# Altium schematic sheet [04] - 7 SEGMENT DISPS.SchDoc: 7 SEGMENT DISPLAYS
size 433 x 279 mm; Author: ZAG; DrawnBy: ZAG; DocumentNumber: 5; SheetNumber: 4; SheetTotal: 7; PageSetup: Record=PageOptions|CenterHorizontal=True|CenterVertical=True|PrintScale=0.96|XCorrection=1.00|YCorrection=1.00|PrintKind=2|BorderSize=5000000|LeftOffset=0|BottomOffset=0|Orientation=2|PaperLength=4318|PaperWidth=2794|Scale=100|PaperSource=15|PrintQuality=600|MediaType=1|DitherType=10|PaperKind=11x17|PrintScaleMode=1; ClientCompanyName: Mule Labs, LLC; ClientContactEmail: zack@mule-labs.com; PCBRevision: 01; SchRevision: 01; Project: YOUTUBE SUBSCRIBER COUNTER; SchStatus: PRELIMINARY
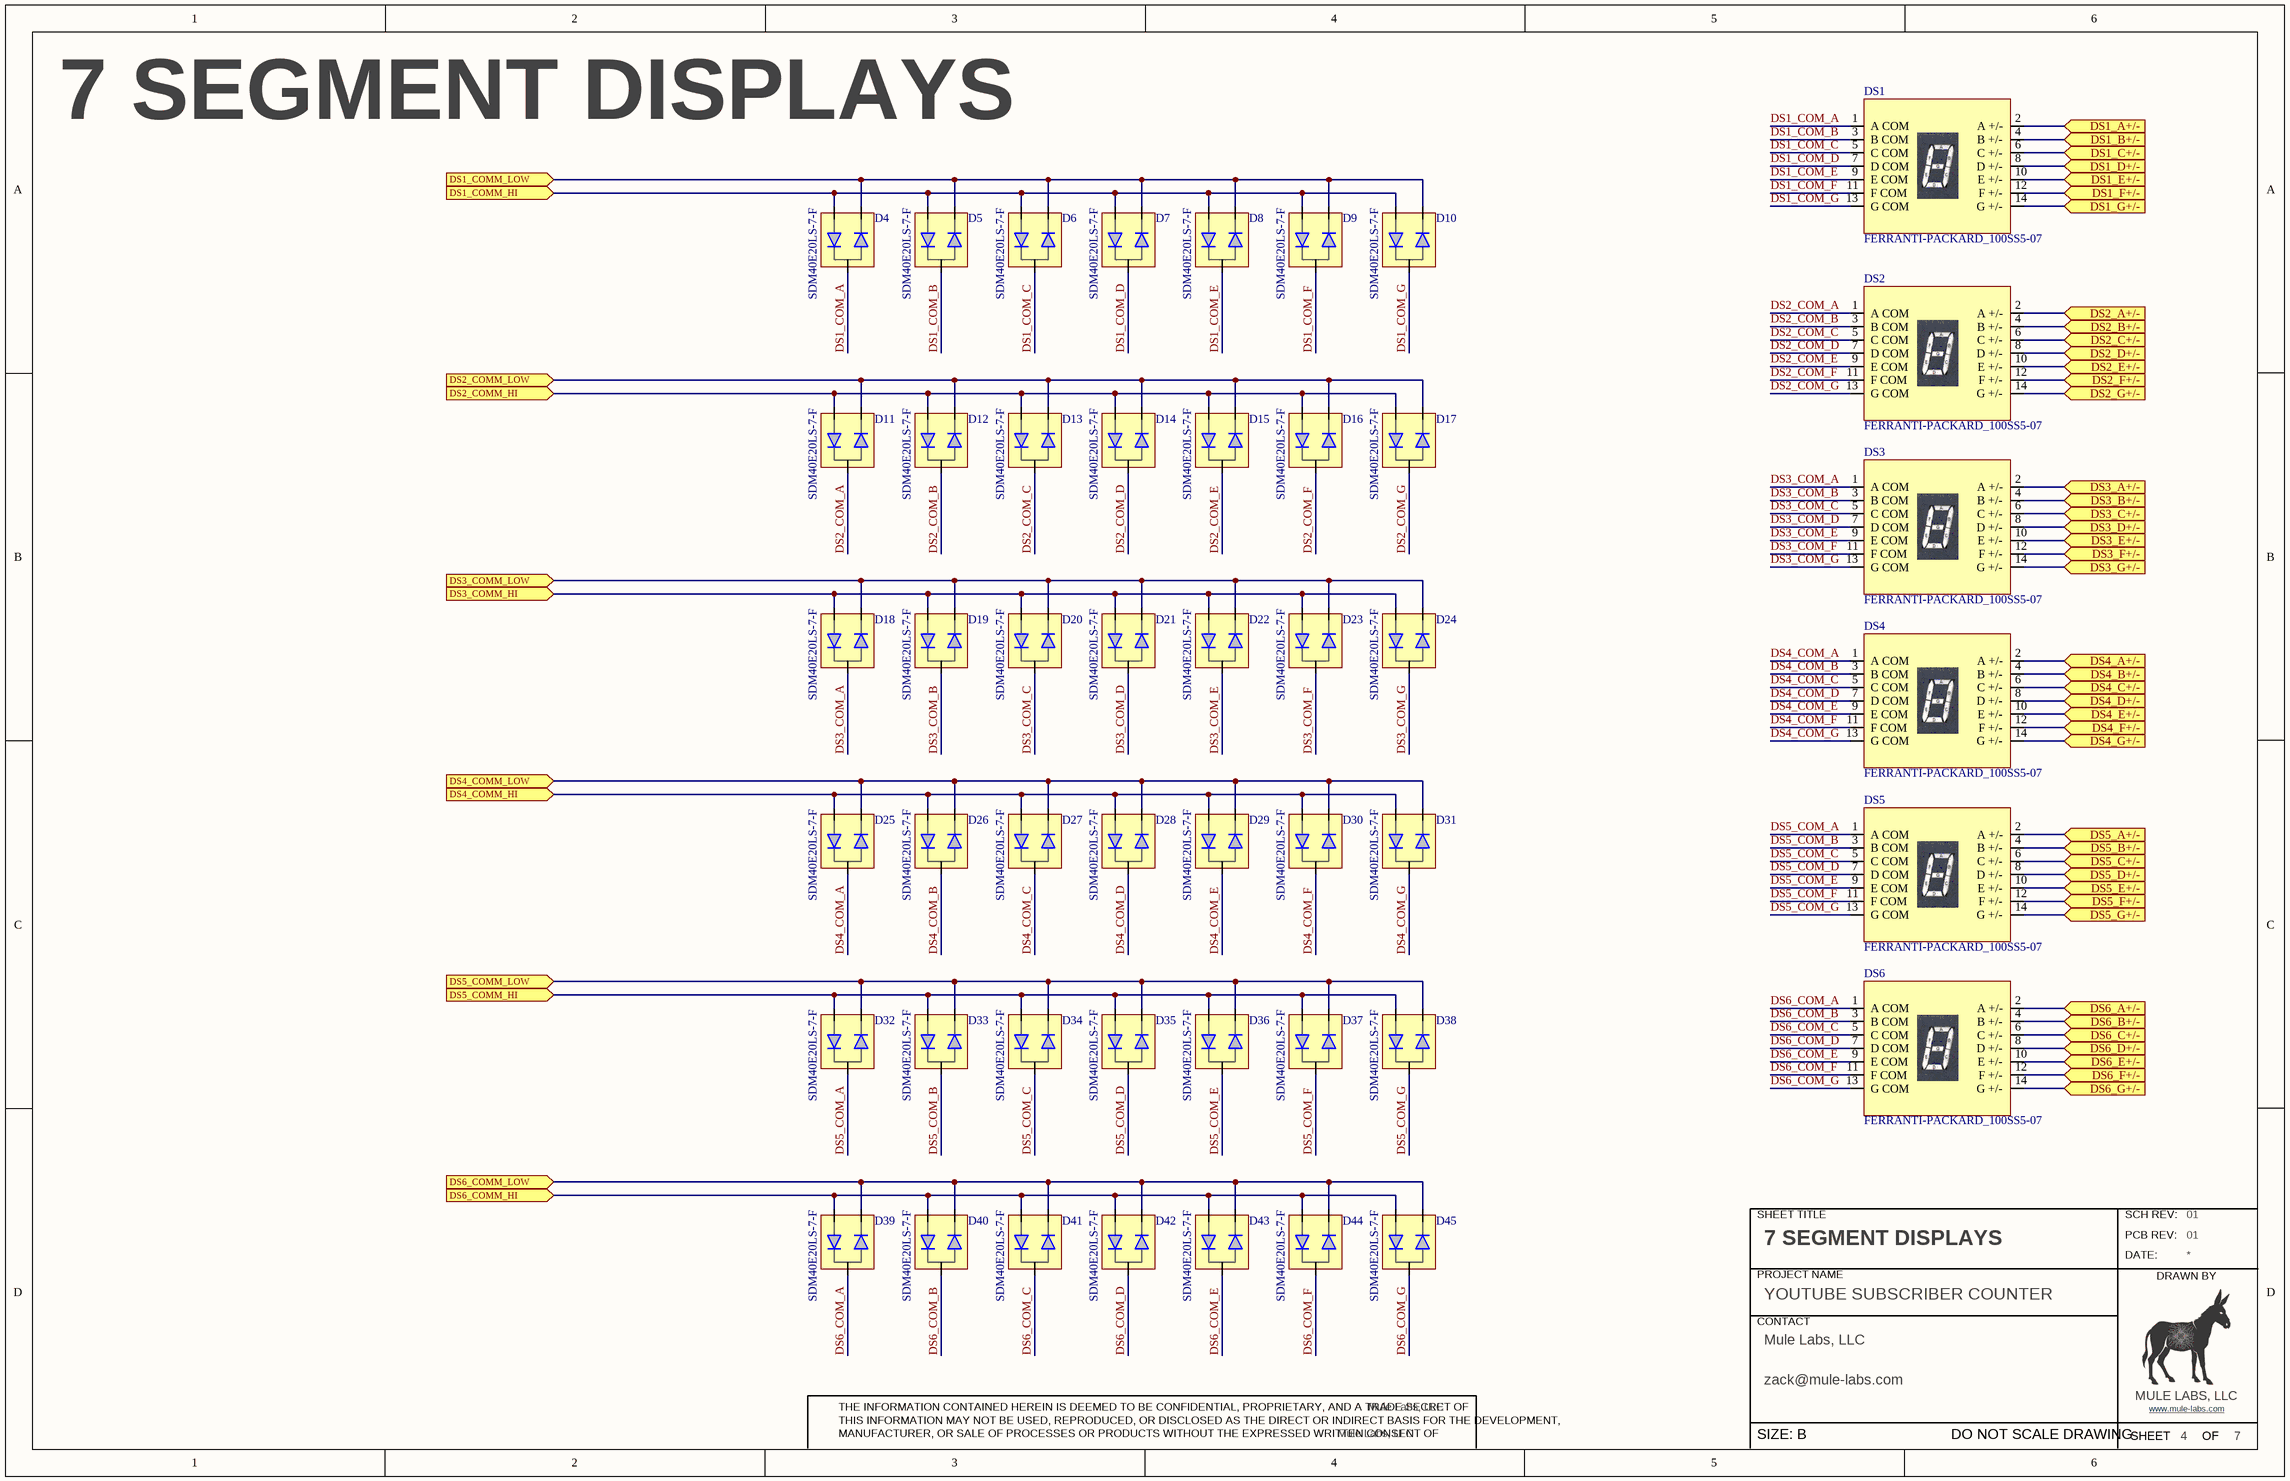
[diagram p0: [04] - 7 SEGMENT DISPS.SchDoc]

## Parts
D4  SDM40E20LS-7-F  [SOT23-3P95_240X110L40X44]
D5  SDM40E20LS-7-F  [SOT23-3P95_240X110L40X44]
D6  SDM40E20LS-7-F  [SOT23-3P95_240X110L40X44]
D7  SDM40E20LS-7-F  [SOT23-3P95_240X110L40X44]
D8  SDM40E20LS-7-F  [SOT23-3P95_240X110L40X44]
D9  SDM40E20LS-7-F  [SOT23-3P95_240X110L40X44]
D10  SDM40E20LS-7-F  [SOT23-3P95_240X110L40X44]
D11  SDM40E20LS-7-F  [SOT23-3P95_240X110L40X44]
D12  SDM40E20LS-7-F  [SOT23-3P95_240X110L40X44]
D13  SDM40E20LS-7-F  [SOT23-3P95_240X110L40X44]
D14  SDM40E20LS-7-F  [SOT23-3P95_240X110L40X44]
D15  SDM40E20LS-7-F  [SOT23-3P95_240X110L40X44]
D16  SDM40E20LS-7-F  [SOT23-3P95_240X110L40X44]
D17  SDM40E20LS-7-F  [SOT23-3P95_240X110L40X44]
D18  SDM40E20LS-7-F  [SOT23-3P95_240X110L40X44]
D19  SDM40E20LS-7-F  [SOT23-3P95_240X110L40X44]
D20  SDM40E20LS-7-F  [SOT23-3P95_240X110L40X44]
D21  SDM40E20LS-7-F  [SOT23-3P95_240X110L40X44]
D22  SDM40E20LS-7-F  [SOT23-3P95_240X110L40X44]
D23  SDM40E20LS-7-F  [SOT23-3P95_240X110L40X44]
D24  SDM40E20LS-7-F  [SOT23-3P95_240X110L40X44]
D25  SDM40E20LS-7-F  [SOT23-3P95_240X110L40X44]
D26  SDM40E20LS-7-F  [SOT23-3P95_240X110L40X44]
D27  SDM40E20LS-7-F  [SOT23-3P95_240X110L40X44]
D28  SDM40E20LS-7-F  [SOT23-3P95_240X110L40X44]
D29  SDM40E20LS-7-F  [SOT23-3P95_240X110L40X44]
D30  SDM40E20LS-7-F  [SOT23-3P95_240X110L40X44]
D31  SDM40E20LS-7-F  [SOT23-3P95_240X110L40X44]
D32  SDM40E20LS-7-F  [SOT23-3P95_240X110L40X44]
D33  SDM40E20LS-7-F  [SOT23-3P95_240X110L40X44]
D34  SDM40E20LS-7-F  [SOT23-3P95_240X110L40X44]
D35  SDM40E20LS-7-F  [SOT23-3P95_240X110L40X44]
D36  SDM40E20LS-7-F  [SOT23-3P95_240X110L40X44]
D37  SDM40E20LS-7-F  [SOT23-3P95_240X110L40X44]
D38  SDM40E20LS-7-F  [SOT23-3P95_240X110L40X44]
D39  SDM40E20LS-7-F  [SOT23-3P95_240X110L40X44]
D40  SDM40E20LS-7-F  [SOT23-3P95_240X110L40X44]
D41  SDM40E20LS-7-F  [SOT23-3P95_240X110L40X44]
D42  SDM40E20LS-7-F  [SOT23-3P95_240X110L40X44]
D43  SDM40E20LS-7-F  [SOT23-3P95_240X110L40X44]
D44  SDM40E20LS-7-F  [SOT23-3P95_240X110L40X44]
D45  SDM40E20LS-7-F  [SOT23-3P95_240X110L40X44]
DS1  FERRANTI-PACKARD_100SS5-07  [FERRANTI_EM_7SEG]
DS2  FERRANTI-PACKARD_100SS5-07  [FERRANTI_EM_7SEG]
DS3  FERRANTI-PACKARD_100SS5-07  [FERRANTI_EM_7SEG]
DS4  FERRANTI-PACKARD_100SS5-07  [FERRANTI_EM_7SEG]
DS5  FERRANTI-PACKARD_100SS5-07  [FERRANTI_EM_7SEG]
DS6  FERRANTI-PACKARD_100SS5-07  [FERRANTI_EM_7SEG]

## Ports
DS1_A+/- (in), DS1_B+/- (in), DS1_C+/- (in), DS1_COMM_HI (in), DS1_COMM_LOW (in), DS1_D+/- (in), DS1_E+/- (in), DS1_F+/- (in), DS1_G+/- (in), DS2_A+/- (in), DS2_B+/- (in), DS2_C+/- (in), DS2_COMM_HI (in), DS2_COMM_LOW (in), DS2_D+/- (in), DS2_E+/- (in), DS2_F+/- (in), DS2_G+/- (in), DS3_A+/- (in), DS3_B+/- (in), DS3_C+/- (in), DS3_COMM_HI (in), DS3_COMM_LOW (in), DS3_D+/- (in), DS3_E+/- (in), DS3_F+/- (in), DS3_G+/- (in), DS4_A+/- (in), DS4_B+/- (in), DS4_C+/- (in), DS4_COMM_HI (in), DS4_COMM_LOW (in), DS4_D+/- (in), DS4_E+/- (in), DS4_F+/- (in), DS4_G+/- (in), DS5_A+/- (in), DS5_B+/- (in), DS5_C+/- (in), DS5_COMM_HI (in), DS5_COMM_LOW (in), DS5_D+/- (in), DS5_E+/- (in), DS5_F+/- (in), DS5_G+/- (in), DS6_A+/- (in), DS6_B+/- (in), DS6_C+/- (in), DS6_COMM_HI (in), DS6_COMM_LOW (in), DS6_D+/- (in), DS6_E+/- (in), DS6_F+/- (in), DS6_G+/- (in)

## Nets
DS1_A+/-: DS1.2(A_+/-) ; port DS1_A+/-
DS1_B+/-: DS1.4(B_+/-) ; port DS1_B+/-
DS1_C+/-: DS1.6(C_+/-) ; port DS1_C+/-
DS1_COM_A: D4.3 DS1.1(A_COM)
DS1_COM_B: D5.3 DS1.3(B_COM)
DS1_COM_C: D6.3 DS1.5(C_COM)
DS1_COM_D: D7.3 DS1.7(D_COM)
DS1_COM_E: D8.3 DS1.9(E_COM)
DS1_COM_F: D9.3 DS1.11(F_COM)
DS1_COM_G: D10.3 DS1.13(G_COM)
DS1_COMM_HI: D4.1 D5.1 D6.1 D7.1 D8.1 D9.1 D10.1 ; port DS1_COMM_HI
DS1_COMM_LOW: D4.2 D5.2 D6.2 D7.2 D8.2 D9.2 D10.2 ; port DS1_COMM_LOW
DS1_D+/-: DS1.8(D_+/-) ; port DS1_D+/-
DS1_E+/-: DS1.10(E_+/-) ; port DS1_E+/-
DS1_F+/-: DS1.12(F_+/-) ; port DS1_F+/-
DS1_G+/-: DS1.14(G_+/-) ; port DS1_G+/-
DS2_A+/-: DS2.2(A_+/-) ; port DS2_A+/-
DS2_B+/-: DS2.4(B_+/-) ; port DS2_B+/-
DS2_C+/-: DS2.6(C_+/-) ; port DS2_C+/-
DS2_COM_A: D11.3 DS2.1(A_COM)
DS2_COM_B: D12.3 DS2.3(B_COM)
DS2_COM_C: D13.3 DS2.5(C_COM)
DS2_COM_D: D14.3 DS2.7(D_COM)
DS2_COM_E: D15.3 DS2.9(E_COM)
DS2_COM_F: D16.3 DS2.11(F_COM)
DS2_COM_G: D17.3 DS2.13(G_COM)
DS2_COMM_HI: D11.1 D12.1 D13.1 D14.1 D15.1 D16.1 D17.1 ; port DS2_COMM_HI
DS2_COMM_LOW: D11.2 D12.2 D13.2 D14.2 D15.2 D16.2 D17.2 ; port DS2_COMM_LOW
DS2_D+/-: DS2.8(D_+/-) ; port DS2_D+/-
DS2_E+/-: DS2.10(E_+/-) ; port DS2_E+/-
DS2_F+/-: DS2.12(F_+/-) ; port DS2_F+/-
DS2_G+/-: DS2.14(G_+/-) ; port DS2_G+/-
DS3_A+/-: DS3.2(A_+/-) ; port DS3_A+/-
DS3_B+/-: DS3.4(B_+/-) ; port DS3_B+/-
DS3_C+/-: DS3.6(C_+/-) ; port DS3_C+/-
DS3_COM_A: D18.3 DS3.1(A_COM)
DS3_COM_B: D19.3 DS3.3(B_COM)
DS3_COM_C: D20.3 DS3.5(C_COM)
DS3_COM_D: D21.3 DS3.7(D_COM)
DS3_COM_E: D22.3 DS3.9(E_COM)
DS3_COM_F: D23.3 DS3.11(F_COM)
DS3_COM_G: D24.3 DS3.13(G_COM)
DS3_COMM_HI: D18.1 D19.1 D20.1 D21.1 D22.1 D23.1 D24.1 ; port DS3_COMM_HI
DS3_COMM_LOW: D18.2 D19.2 D20.2 D21.2 D22.2 D23.2 D24.2 ; port DS3_COMM_LOW
DS3_D+/-: DS3.8(D_+/-) ; port DS3_D+/-
DS3_E+/-: DS3.10(E_+/-) ; port DS3_E+/-
DS3_F+/-: DS3.12(F_+/-) ; port DS3_F+/-
DS3_G+/-: DS3.14(G_+/-) ; port DS3_G+/-
DS4_A+/-: DS4.2(A_+/-) ; port DS4_A+/-
DS4_B+/-: DS4.4(B_+/-) ; port DS4_B+/-
DS4_C+/-: DS4.6(C_+/-) ; port DS4_C+/-
DS4_COM_A: D25.3 DS4.1(A_COM)
DS4_COM_B: D26.3 DS4.3(B_COM)
DS4_COM_C: D27.3 DS4.5(C_COM)
DS4_COM_D: D28.3 DS4.7(D_COM)
DS4_COM_E: D29.3 DS4.9(E_COM)
DS4_COM_F: D30.3 DS4.11(F_COM)
DS4_COM_G: D31.3 DS4.13(G_COM)
DS4_COMM_HI: D25.1 D26.1 D27.1 D28.1 D29.1 D30.1 D31.1 ; port DS4_COMM_HI
DS4_COMM_LOW: D25.2 D26.2 D27.2 D28.2 D29.2 D30.2 D31.2 ; port DS4_COMM_LOW
DS4_D+/-: DS4.8(D_+/-) ; port DS4_D+/-
DS4_E+/-: DS4.10(E_+/-) ; port DS4_E+/-
DS4_F+/-: DS4.12(F_+/-) ; port DS4_F+/-
DS4_G+/-: DS4.14(G_+/-) ; port DS4_G+/-
DS5_A+/-: DS5.2(A_+/-) ; port DS5_A+/-
DS5_B+/-: DS5.4(B_+/-) ; port DS5_B+/-
DS5_C+/-: DS5.6(C_+/-) ; port DS5_C+/-
DS5_COM_A: D32.3 DS5.1(A_COM)
DS5_COM_B: D33.3 DS5.3(B_COM)
DS5_COM_C: D34.3 DS5.5(C_COM)
DS5_COM_D: D35.3 DS5.7(D_COM)
DS5_COM_E: D36.3 DS5.9(E_COM)
DS5_COM_F: D37.3 DS5.11(F_COM)
DS5_COM_G: D38.3 DS5.13(G_COM)
DS5_COMM_HI: D32.1 D33.1 D34.1 D35.1 D36.1 D37.1 D38.1 ; port DS5_COMM_HI
DS5_COMM_LOW: D32.2 D33.2 D34.2 D35.2 D36.2 D37.2 D38.2 ; port DS5_COMM_LOW
DS5_D+/-: DS5.8(D_+/-) ; port DS5_D+/-
DS5_E+/-: DS5.10(E_+/-) ; port DS5_E+/-
DS5_F+/-: DS5.12(F_+/-) ; port DS5_F+/-
DS5_G+/-: DS5.14(G_+/-) ; port DS5_G+/-
DS6_A+/-: DS6.2(A_+/-) ; port DS6_A+/-
DS6_B+/-: DS6.4(B_+/-) ; port DS6_B+/-
DS6_C+/-: DS6.6(C_+/-) ; port DS6_C+/-
DS6_COM_A: D39.3 DS6.1(A_COM)
DS6_COM_B: D40.3 DS6.3(B_COM)
DS6_COM_C: D41.3 DS6.5(C_COM)
DS6_COM_D: D42.3 DS6.7(D_COM)
DS6_COM_E: D43.3 DS6.9(E_COM)
DS6_COM_F: D44.3 DS6.11(F_COM)
DS6_COM_G: D45.3 DS6.13(G_COM)
DS6_COMM_HI: D39.1 D40.1 D41.1 D42.1 D43.1 D44.1 D45.1 ; port DS6_COMM_HI
DS6_COMM_LOW: D39.2 D40.2 D41.2 D42.2 D43.2 D44.2 D45.2 ; port DS6_COMM_LOW
DS6_D+/-: DS6.8(D_+/-) ; port DS6_D+/-
DS6_E+/-: DS6.10(E_+/-) ; port DS6_E+/-
DS6_F+/-: DS6.12(F_+/-) ; port DS6_F+/-
DS6_G+/-: DS6.14(G_+/-) ; port DS6_G+/-

## Notes on the sheet
- SHEET TITLE
- SCH REV:
- PROJECT NAME
- PCB REV:
- DATE:
- DRAWN BY
- CONTACT
- MANUFACTURER, OR SALE OF PROCESSES OR PRODUCTS WITHOUT THE EXPRESSED WRITTEN CONSENT OF
- THE INFORMATION CONTAINED HEREIN IS DEEMED TO BE CONFIDENTIAL, PROPRIETARY, AND A TRADE SECRET OF
- THIS INFORMATION MAY NOT BE USED, REPRODUCED, OR DISCLOSED AS THE DIRECT OR INDIRECT BASIS FOR THE DEVELOPMENT,
- SHEET
- MULE LABS, LLC
- www.mule-labs.com <http://www.mule-labs.com>
- OF
- SIZE: B
- DO NOT SCALE DRAWING

## Library data of the parts
D4-D45 = SDM40E20LS-7-F: DIODE ARRAY SCHOTTKY 20V SOT23-3; Manufacturer: Diodes; Max Power Dissipation: 300mW; Forward Current: 400mA; Peak Reverse Current: 250uA; Forward Voltage: 430mV; Max Forward Surge Current (Ifsm): 2A; Capacitance: 170pF; Supplier 1: Digi-Key; Manufacturer Part Number: SDM40E20LS-7-F; RoHS: Yes; Stock 1: 64457; Pricing 1: 1 = 0.45000, 10 = 0.38200, 100 = 0.28550, 500 = 0.22434, 1000 = 0.17335 (USD); Mount: Surface Mount; Case/Package: SOT-23; Number of Pins: 3; Weight: 0.000282oz; Min Operating Temperature: -65°C; Max Operating Temperature: 125°C; Package Quantity: 3000; Packaging: Tape and Reel; Average Rectified Current: 400mA; Max Repetitive Reverse Voltage (Vrrm): 20V; Peak Non-Repetitive Surge Current: 2A; Power Dissipation: 300mW; Termination: SMD/SMT; Current Rating: 400mA; Power Rating: 300mW; Voltage Rating (DC): 20V; Max Reverse Voltage (DC): 20V; Length: 3mm; Height: 1.1mm; Width: 1.4mm; Radiation Hardening: No; REACH SVHC: No SVHC; Lead Free: Lead Free; ComponentLink1URL: https://datasheet.ciiva.com/905/ds30298-905328.pdf?src-supplier=Digi-Key; ComponentLink1Description: https://datasheet.ciiva.com/905/ds30298-905328.pdf?src-supplier=Digi-Key; ComponentLink2URL: https://datasheet.ciiva.com/4715/ds30298-90424-4715745.pdf?src-supplier=Mouser; ComponentLink2Description: https://datasheet.ciiva.com/4715/ds30298-90424-4715745.pdf?src-supplier=Mouser; ComponentLink3URL: https://datasheet.ciiva.com/8301/ds30298-8301189.pdf?src-supplier=Avnet; ComponentLink3Description: https://datasheet.ciiva.com/8301/ds30298-8301189.pdf?src-supplier=Avnet; ComponentLink4URL: https://datasheet.ciiva.com/8301/ds30298-8301192.pdf?src-supplier=Avnet; ComponentLink4Description: https://datasheet.ciiva.com/8301/ds30298-8301192.pdf?src-supplier=Avnet; ComponentLink5URL: https://datasheet.ciiva.com/25945/ds30298-25945688.pdf?src-supplier=Avnet+Europe; ComponentLink5Description: https://datasheet.ciiva.com/25945/ds30298-25945688.pdf?src-supplier=Avnet+Europe; ComponentLink6URL: https://datasheet.ciiva.com/16200/ds30298-16200250.pdf?src-supplier=Future+Electronics; ComponentLink6Description: https://datasheet.ciiva.com/16200/ds30298-16200250.pdf?src-supplier=Future+Electronics; ComponentLink7URL: https://datasheet.ciiva.com/22695/639200-22695851.pdf?src-supplier=Element14; ComponentLink7Description: https://datasheet.ciiva.com/22695/639200-22695851.pdf?src-supplier=Element14; ComponentLink8URL: https://datasheet.ciiva.com/905/ds30298-905326.pdf?src-supplier=Digi-Key; ComponentLink8Description: https://datasheet.ciiva.com/905/ds30298-905326.pdf?src-supplier=Digi-Key; ComponentLink9URL: https://datasheet.ciiva.com/7964/ds30298-7964334.pdf?src-supplier=Element14; ComponentLink9Description: https://datasheet.ciiva.com/7964/ds30298-7964334.pdf?src-supplier=Element14; ComponentLink10URL: https://datasheet.ciiva.com/905/ds30298-905327.pdf?src-supplier=Digi-Key; ComponentLink10Description: https://datasheet.ciiva.com/905/ds30298-905327.pdf?src-supplier=Digi-Key; Supplier Part Number 1: SDM40E20LS-FDICT-ND
DS1-DS6 = FERRANTI_PACKARD_7SEG: ELECTROMECHANICAL 7-SEGMENT DISPLAY